# Altium schematic sheet Misc_switches.SchDoc: RP2040 CNC
size B; Author: AM; CompanyName: Expatria Technologies; DrawnBy: A.Marles; Engineer: AM; Organization: Expatria Technolgoies; DocumentNumber: 8; SheetNumber: 8; SheetTotal: 14
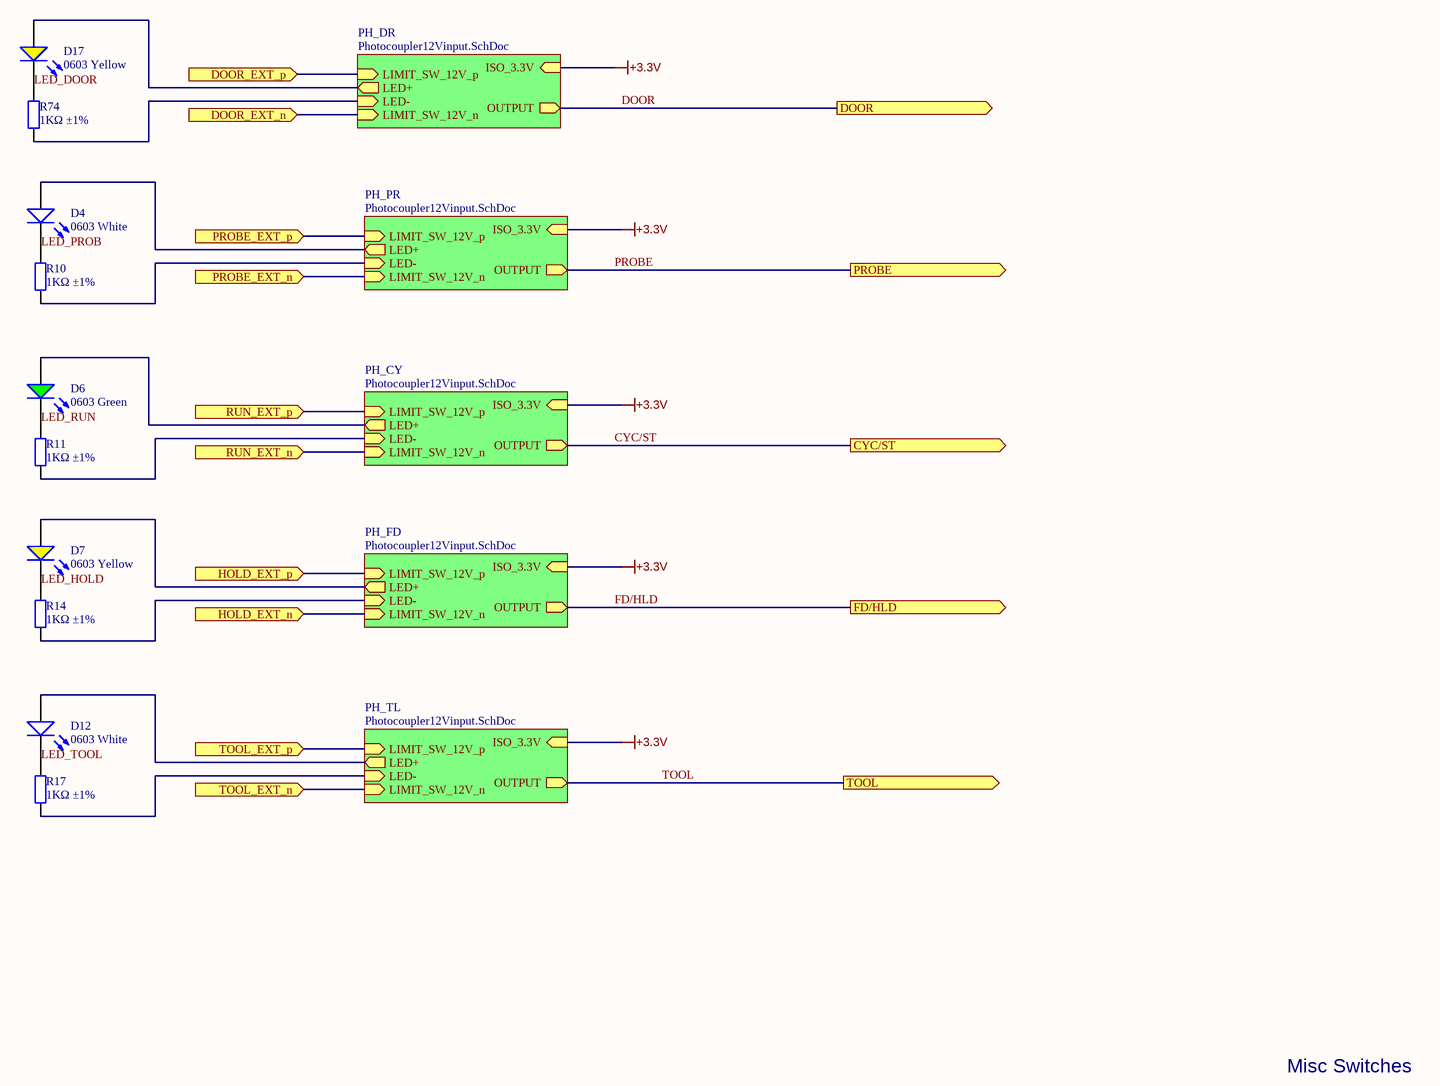
[diagram p0: Misc_switches.SchDoc]

## Parts
D4  0603 White  [0603_LED_S1]
D6  0603 Green  [0603_LED_S1]
D7  0603 Yellow  [0603_LED_S1]
D12  0603 White  [0603_LED_S1]
D17  0603 Yellow  [0603_LED_S1]
R10  1KΩ ±1%  [0603_R]
R11  1KΩ ±1%  [0603_R]
R14  1KΩ ±1%  [0603_R]
R17  1KΩ ±1%  [0603_R]
R74  1KΩ ±1%  [0603_R]

## Sub-sheets
PH_CY = Photocoupler12Vinput.SchDoc: OUTPUT (out), LED- (in), LED+ (out), ISO_3.3V (in), LIMIT_SW_12V_n (in), LIMIT_SW_12V_p (in)
PH_DR = Photocoupler12Vinput.SchDoc: OUTPUT (out), LED+ (out), LED- (in), ISO_3.3V (in), LIMIT_SW_12V_n (in), LIMIT_SW_12V_p (in)
PH_FD = Photocoupler12Vinput.SchDoc: OUTPUT (out), LED+ (out), LED- (in), ISO_3.3V (in), LIMIT_SW_12V_n (in), LIMIT_SW_12V_p (in)
PH_PR = Photocoupler12Vinput.SchDoc: OUTPUT (out), LED+ (out), LED- (in), ISO_3.3V (in), LIMIT_SW_12V_n (in), LIMIT_SW_12V_p (in)
PH_TL = Photocoupler12Vinput.SchDoc: OUTPUT (out), LED+ (out), LED- (in), ISO_3.3V (in), LIMIT_SW_12V_n (in), LIMIT_SW_12V_p (in)

## Ports
CYC/ST (out), DOOR (out), DOOR_EXT_n (in), DOOR_EXT_p (in), FD/HLD (out), HOLD_EXT_n (in), HOLD_EXT_p (in), PROBE (out), PROBE_EXT_n (in), PROBE_EXT_p (in), RUN_EXT_n (in), RUN_EXT_p (in), TOOL (out), TOOL_EXT_n (in), TOOL_EXT_p (in)

## Nets
+3.3V: sheet PH_CY/ISO_3.3V, sheet PH_FD/ISO_3.3V, sheet PH_DR/ISO_3.3V, sheet PH_TL/ISO_3.3V, sheet PH_PR/ISO_3.3V
CYC/ST: port CYC/ST, sheet PH_CY/OUTPUT
DOOR: port DOOR, sheet PH_DR/OUTPUT
DOOR_EXT_n: port DOOR_EXT_n, sheet PH_DR/LIMIT_SW_12V_n
DOOR_EXT_p: port DOOR_EXT_p, sheet PH_DR/LIMIT_SW_12V_p
FD/HLD: port FD/HLD, sheet PH_FD/OUTPUT
HOLD_EXT_n: port HOLD_EXT_n, sheet PH_FD/LIMIT_SW_12V_n
HOLD_EXT_p: port HOLD_EXT_p, sheet PH_FD/LIMIT_SW_12V_p
LED_DOOR: D17.K R74.1
LED_HOLD: D7.K R14.1
LED_PROB: D4.K R10.1
LED_RUN: D6.K R11.1
LED_TOOL: D12.K R17.1
PROBE: port PROBE, sheet PH_PR/OUTPUT
PROBE_EXT_n: port PROBE_EXT_n, sheet PH_PR/LIMIT_SW_12V_n
PROBE_EXT_p: port PROBE_EXT_p, sheet PH_PR/LIMIT_SW_12V_p
RUN_EXT_n: port RUN_EXT_n, sheet PH_CY/LIMIT_SW_12V_n
RUN_EXT_p: port RUN_EXT_p, sheet PH_CY/LIMIT_SW_12V_p
TOOL: port TOOL, sheet PH_TL/OUTPUT
TOOL_EXT_n: port TOOL_EXT_n, sheet PH_TL/LIMIT_SW_12V_n
TOOL_EXT_p: port TOOL_EXT_p, sheet PH_TL/LIMIT_SW_12V_p
NetD4_A: D4.A ; sheet PH_PR/LED+
NetD6_A: D6.A ; sheet PH_CY/LED+
NetD7_A: D7.A ; sheet PH_FD/LED+
NetD12_A: D12.A ; sheet PH_TL/LED+
NetD17_A: D17.A ; sheet PH_DR/LED+
NetR10_2: R10.2 ; sheet PH_PR/LED-
NetR11_2: R11.2 ; sheet PH_CY/LED-
NetR14_2: R14.2 ; sheet PH_FD/LED-
NetR17_2: R17.2 ; sheet PH_TL/LED-
NetR74_2: R74.2 ; sheet PH_DR/LED-

## Notes on the sheet
- Misc Switches
- SHEET
- Expatria Technologies
- 1136 Glade Court
- Port Coquitlam, BC V3B 1R5
- PROJECT
- SIZE
- ENGR
- MODIFIED
- DOCUMENT
- REV
- Copyright Expatria Technologies 2022. This document describes Open Hardware and is licensed under the CERN-OHL-S v2. No warranty is implied or expressed.
- EMAIL: INFO@EXPATRIA.CA
- B
- /

## Library data of the parts
D4 D12 = 0603 LED White: LED; ComponentLink1Description: 供应商链接; ComponentLink1URL: http://www.szlcsc.com/product/details_2663.html; Package: 0603; Supplier: LC; SuppliersPartNumber: C2290; Color: White
D6 = 0603 LED Green: LED; ComponentLink1Description: 供应商链接; ComponentLink1URL: http://www.szlcsc.com/product/details_73152.html; Package: 0603; Supplier: LC; SuppliersPartNumber: C72043; Color: Green
D7 D17 = 0603 LED Yellow: LED; ComponentLink1Description: 供应商链接; ComponentLink1URL: http://www.szlcsc.com/product/details_73147.html; Package: 0603; Supplier: LC; SuppliersPartNumber: C72038; Color: Yellow
R10 R11 R14 R17 R74 = 0603 1K (1001) 1%: Chip resistor; Manufacturer: Uniroyal Elec; PartNumber: 0603WAF1001T5E; Power: 1/10W; ComponentLink1Description: Supplier link; ComponentLink1URL: http://www.szlcsc.com/product/details_21904.html; Package: 0603; Supplier: LC; SuppliersPartNumber: C21190; Resistance: 1KΩ; Tolerance: 1%